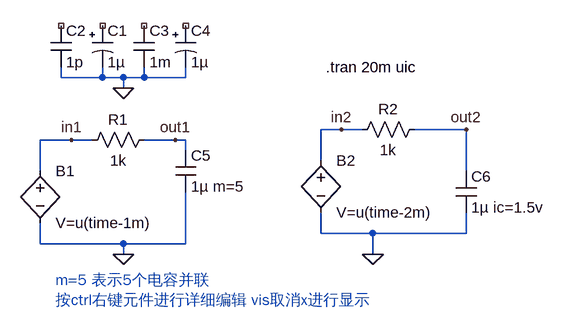
[diagram p0: schematic Draft2.asc]
Draft2.asc, the LTspice schematic file:
Version 4.1
SHEET 1 880 680
WIRE 112 96 112 80
WIRE 176 96 176 80
WIRE 176 96 112 96
WIRE 208 96 176 96
WIRE 240 96 240 80
WIRE 240 96 208 96
WIRE 304 96 304 80
WIRE 304 96 240 96
WIRE 208 112 208 96
WIRE 544 176 512 176
WIRE 576 176 544 176
WIRE 736 176 656 176
WIRE 128 192 80 192
WIRE 160 192 128 192
WIRE 288 192 240 192
WIRE 304 192 288 192
WIRE 304 208 304 192
WIRE 512 224 512 176
WIRE 80 240 80 192
WIRE 736 240 736 176
WIRE 512 336 512 304
WIRE 592 336 512 336
WIRE 736 336 736 304
WIRE 736 336 592 336
WIRE 80 352 80 320
WIRE 208 352 80 352
WIRE 304 352 304 272
WIRE 304 352 208 352
WIRE 208 368 208 352
WIRE 592 368 592 336
FLAG 208 112 0
FLAG 208 368 0
FLAG 288 192 out1
FLAG 592 368 0
FLAG 736 176 out2
FLAG 128 192 in1
FLAG 544 176 in2
SYMBOL polcap 160 16 R0
SYMATTR InstName C1
SYMATTR Value 1µ
SYMBOL cap 96 16 R0
SYMATTR InstName C2
SYMATTR Value 1p
SYMBOL Misc\\EuropeanCap 224 16 R0
SYMATTR InstName C3
SYMATTR Value 1m
SYMBOL Misc\\EuropeanPolcap 288 16 R0
SYMATTR InstName C4
SYMATTR Value 1µ
SYMBOL bv 80 224 R0
SYMATTR InstName B1
SYMATTR Value V=u(time-1m)
SYMBOL res 256 176 R90
WINDOW 0 0 56 VBottom 2
WINDOW 3 32 56 VTop 2
SYMATTR InstName R1
SYMATTR Value 1k
SYMBOL cap 288 208 R0
SYMATTR InstName C5
SYMATTR Value 1µ m=5
SYMBOL res 672 160 R90
WINDOW 0 0 56 VBottom 2
WINDOW 3 32 56 VTop 2
SYMATTR InstName R2
SYMATTR Value 1k
SYMBOL cap 720 240 R0
SYMATTR InstName C6
SYMATTR Value 1µ ic=1.5v
SYMBOL bv 512 208 R0
SYMATTR InstName B2
SYMATTR Value V=u(time-2m)
TEXT 104 408 Left 2 ;m=5 表示5个电容并联\n按ctrl右键元件进行详细编辑 vis取消x进行显示
TEXT 520 80 Left 2 !.tran 20m uic

The netlist it stands for:
* Draft2.asc
C1 NC_01 0 1µ
C2 NC_02 0 1p
C3 NC_03 0 1m
C4 NC_04 0 1µ
B1 in1 0 V=u(time-1m)
R1 out1 in1 1k
C5 out1 0 1µ m=5
R2 out2 in2 1k
C6 out2 0 1µ ic=1.5v
B2 in2 0 V=u(time-2m)
* m=5 表示5个电容并联
* 按ctrl右键元件进行详细编辑 vis取消x进行显示
.tran 20m uic
.backanno
.end